# Altium schematic sheet block.SchDoc
size Letter
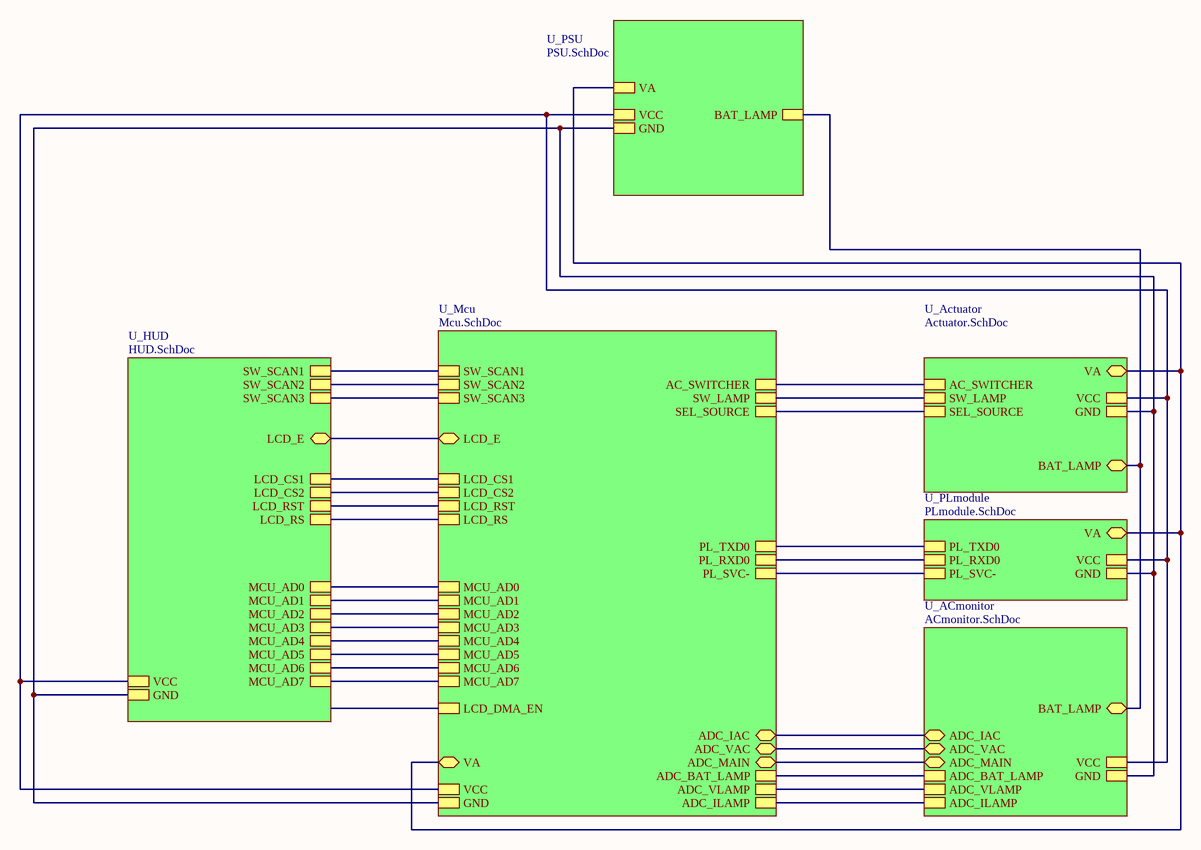
[diagram p0: block.SchDoc]

## Sub-sheets
U_ACmonitor = ACmonitor.SchDoc: ADC_BAT_LAMP, ADC_VLAMP, ADC_ILAMP, VCC, GND, ADC_IAC, ADC_VAC, BAT_LAMP, ADC_MAIN
U_Actuator = Actuator.SchDoc: AC_SWITCHER, SW_LAMP, SEL_SOURCE, VCC, GND, BAT_LAMP, VA
U_HUD = HUD.SchDoc: MCU_AD0, MCU_AD1, MCU_AD2, MCU_AD3, MCU_AD4, MCU_AD5, MCU_AD6, MCU_AD7, LCD_CS1, LCD_CS2, LCD_RST, LCD_RS, SW_SCAN1, SW_SCAN2, SW_SCAN3, VCC, GND, LCD_E
U_Mcu = Mcu.SchDoc: PL_TXD0, PL_RXD0, SW_SCAN1, SW_SCAN2, SW_SCAN3, PL_SVC-, LCD_CS1, LCD_CS2, LCD_RST, LCD_RS, AC_SWITCHER, SW_LAMP, SEL_SOURCE, MCU_AD0, MCU_AD1, MCU_AD2, MCU_AD3, MCU_AD4, MCU_AD5, MCU_AD6, MCU_AD7, VCC, GND, LCD_DMA_EN, ADC_BAT_LAMP, ADC_VLAMP, ADC_ILAMP, ADC_IAC, ADC_VAC, LCD_E, ADC_MAIN, VA
U_PLmodule = PLmodule.SchDoc: PL_SVC-, VCC, GND, PL_TXD0, PL_RXD0, VA
U_PSU = PSU.SchDoc: VCC, GND, BAT_LAMP, VA

## Nets
(unnamed): sheet U_Mcu/PL_TXD0, sheet U_PLmodule/PL_TXD0
(unnamed): sheet U_Mcu/PL_RXD0, sheet U_PLmodule/PL_RXD0
(unnamed): sheet U_Mcu/SW_SCAN1, sheet U_HUD/SW_SCAN1
(unnamed): sheet U_Mcu/SW_SCAN2, sheet U_HUD/SW_SCAN2
(unnamed): sheet U_Mcu/SW_SCAN3, sheet U_HUD/SW_SCAN3
(unnamed): sheet U_Mcu/PL_SVC-, sheet U_PLmodule/PL_SVC-
(unnamed): sheet U_Mcu/LCD_CS1, sheet U_HUD/LCD_CS1
(unnamed): sheet U_Mcu/LCD_CS2, sheet U_HUD/LCD_CS2
(unnamed): sheet U_Mcu/LCD_RST, sheet U_HUD/LCD_RST
(unnamed): sheet U_Mcu/LCD_RS, sheet U_HUD/LCD_RS
(unnamed): sheet U_Mcu/AC_SWITCHER, sheet U_Actuator/AC_SWITCHER
(unnamed): sheet U_Mcu/SW_LAMP, sheet U_Actuator/SW_LAMP
(unnamed): sheet U_Mcu/SEL_SOURCE, sheet U_Actuator/SEL_SOURCE
(unnamed): sheet U_Mcu/MCU_AD0, sheet U_HUD/MCU_AD0
(unnamed): sheet U_Mcu/MCU_AD1, sheet U_HUD/MCU_AD1
(unnamed): sheet U_Mcu/MCU_AD2, sheet U_HUD/MCU_AD2
(unnamed): sheet U_Mcu/MCU_AD3, sheet U_HUD/MCU_AD3
(unnamed): sheet U_Mcu/MCU_AD4, sheet U_HUD/MCU_AD4
(unnamed): sheet U_Mcu/MCU_AD5, sheet U_HUD/MCU_AD5
(unnamed): sheet U_Mcu/MCU_AD6, sheet U_HUD/MCU_AD6
(unnamed): sheet U_Mcu/MCU_AD7, sheet U_HUD/MCU_AD7
(unnamed): sheet U_Mcu/VCC, sheet U_Actuator/VCC, sheet U_PSU/VCC, sheet U_HUD/VCC, sheet U_PLmodule/VCC, sheet U_ACmonitor/VCC
(unnamed): sheet U_Mcu/GND, sheet U_Actuator/GND, sheet U_PSU/GND, sheet U_HUD/GND, sheet U_PLmodule/GND, sheet U_ACmonitor/GND
(unnamed): sheet U_Mcu/ADC_BAT_LAMP, sheet U_ACmonitor/ADC_BAT_LAMP
(unnamed): sheet U_Mcu/ADC_VLAMP, sheet U_ACmonitor/ADC_VLAMP
(unnamed): sheet U_Mcu/ADC_ILAMP, sheet U_ACmonitor/ADC_ILAMP
(unnamed): sheet U_Mcu/ADC_IAC, sheet U_ACmonitor/ADC_IAC
(unnamed): sheet U_Mcu/ADC_VAC, sheet U_ACmonitor/ADC_VAC
(unnamed): sheet U_Mcu/LCD_E, sheet U_HUD/LCD_E
(unnamed): sheet U_Mcu/ADC_MAIN, sheet U_ACmonitor/ADC_MAIN
(unnamed): sheet U_Mcu/VA, sheet U_Actuator/VA, sheet U_PSU/VA, sheet U_PLmodule/VA
(unnamed): sheet U_Actuator/BAT_LAMP, sheet U_PSU/BAT_LAMP, sheet U_ACmonitor/BAT_LAMP